# Altium project MdBBCar_CenterBoard.PrjPcb
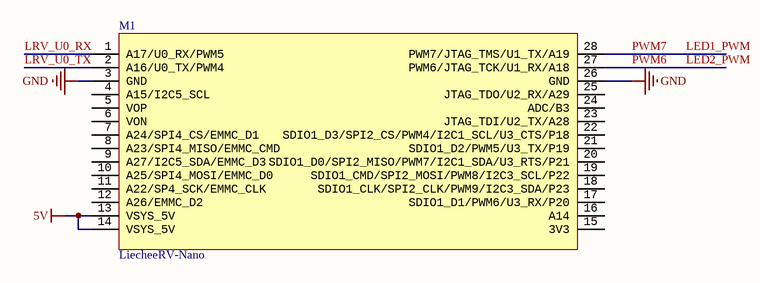
[diagram p0: MaixCAMPort.SchDoc]
4 sheets, 39 parts. Net scope: global (net labels, ports and power ports of the same name join across sheets).
Board file: MdBBCar_CenterBoad.PcbDoc
Sheets:
  MaixCAMPort.SchDoc
  CarPower.SchDoc
  Connector.SchDoc
  GimbalFPV.SchDoc

## Sheet MaixCAMPort.SchDoc
size A4; SheetNumber: 1; SheetTotal: 4

### Parts
M1  LiecheeRV-Nano  [LicheeRV-Nano(SDIO_NC)-半孔探针]

### Nets
5V: M1.13(VSYS_5V) M1.14(VSYS_5V)
GND: M1.3(GND) M1.26(GND)
LED1_PWM: M1.28(PWM7/JTAG_TMS/U1_TX/A19)  [also labelled PWM7]
LED2_PWM: M1.27(PWM6/JTAG_TCK/U1_RX/A18)  [also labelled PWM6]
LRV_U0_RX: M1.1(A17/U0_RX/PWM5)
LRV_U0_TX: M1.2(A16/U0_TX/PWM4)

Not connected (* = marked no-connect by the designer): M1 4(A15/I2C5_SCL) 5(VOP) 6(VON) 7(A24/SPI4_CS/EMMC_D1) 8(A23/SPI4_MISO/EMMC_CMD) 9(A27/I2C5_SDA/EMMC_D3) 10(A25/SPI4_MOSI/EMMC_D0) 11(A22/SP4_SCK/EMMC_CLK) 12(A26/EMMC_D2) 15(3V3) 16(A14) 17(SDIO1_D1/PWM6/U3_RX/P20) 18(SDIO1_CLK/SPI2_CLK/PWM9/I2C3_SDA/P23) 19(SDIO1_CMD/SPI2_MOSI/PWM8/I2C3_SCL/P22) 20(SDIO1_D0/SPI2_MISO/PWM7/I2C1_SDA/U3_RTS/P21) 21(SDIO1_D2/PWM5/U3_TX/P19) 22(SDIO1_D3/SPI2_CS/PWM4/I2C1_SCL/U3_CTS/P18) 23(JTAG_TDI/U2_TX/A28) 24(ADC/B3) 25(JTAG_TDO/U2_RX/A29)

### Library data of the parts
M1 = LiecheeRV-Nano: Sipeed MaixCAM模块

## Sheet CarPower.SchDoc
size A4; SheetNumber: 2; SheetTotal: 4
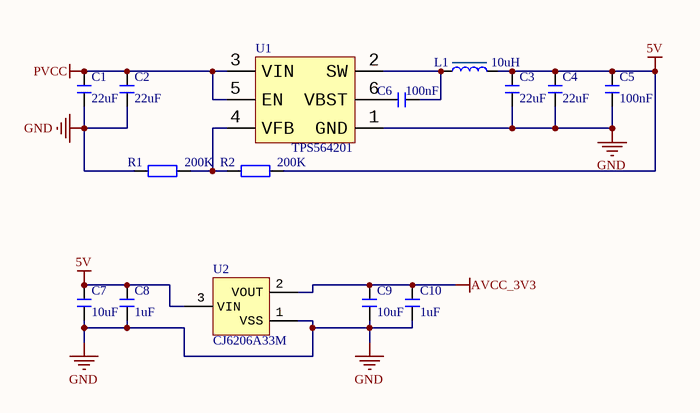
[diagram p1: CarPower.SchDoc]

### Parts
C1  22uF  [C 0805_L]
C2  22uF  [C 0805_L]
C3  22uF  [C 0603_L]
C4  22uF  [C 0603_L]
C5  100nF  [C 0402_L]
C6  100nF  [C 0402_L]
C7  10uF  [C 0402_L]
C8  1uF  [C 0402_L]
C9  10uF  [C 0402_L]
C10  1uF  [C 0402_L]
L1  10uH  [L-0630]
R1  200K  [R 0402_L]
R2  200K  [R 0402_L]
U1  TPS564201  [SOT23-6L]
U2  CJ6206A33M  [SOT23-3L]

### Nets
5V: C3.2 C4.2 C5.2 C7.2 C8.2 L1.2 R2.2 U2.3(VIN)
AVCC_3V3: C9.2 C10.2 U2.2(VOUT)
GND: C1.1 C2.1 C3.1 C4.1 C5.1 C7.1 C8.1 C9.1 C10.1 R1.1 U1.1(GND) U2.1(VSS)
PVCC: C1.2 C2.2 U1.3(VIN) U1.5(EN)
NetC6_1: C6.1 U1.6(VBST)
NetC6_2: C6.2 L1.1 U1.2(SW)
NetR1_2: R1.2 R2.1 U1.4(VFB)

### Library data of the parts
C1-C10 = C: 无极性贴片电容; 版权归属: 源创客; BOM名称: 无极性贴片电容; 学习资源: www.ooocke.com
L1 = L-CD: 贴片功率电感; BOM名称: 功率电感; 版权归属: 源创客; 学习资源: www.ooocke.com
R1 R2 = R: 贴片电阻; 版权归属: 源创客; BOM名称: 贴片电阻; 学习资源: www.ooocke.com
U1 = TPS563200: 3A  4.5V-17V输入 同步
U2 = LN6206PXXX: 三端稳压芯片 / 6V 250mA

## Sheet Connector.SchDoc
size A4; SheetNumber: 3; SheetTotal: 3
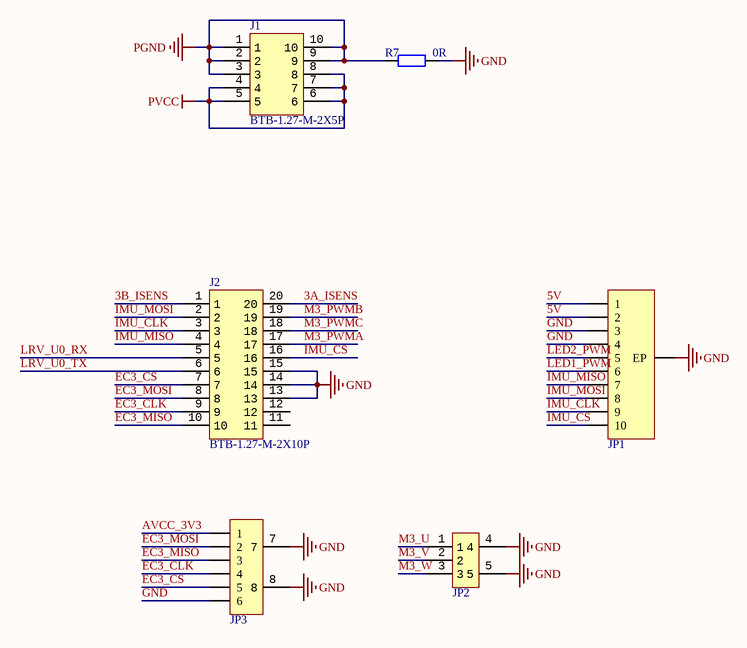
[diagram p2: Connector.SchDoc]

### Parts
J1  BTB-1.27-M-2X5P  [1.27-M-2X5P]
J2  BTB-1.27-M-2X10P  [1.27-M-2X10P]
JP1  FPC1.0-10P  [FPC0.5 1H-WS-10P]  (value not drawn)
JP2  HDR-1X3  [GH 1.25-LS-3P]  (value not drawn)
JP3  HDR-1X6  [GH1.25-LS-6P]  (value not drawn)
R7  0R  [R 1206_L]

### Nets
5V: JP1.1 JP1.2
AVCC_3V3: JP3.1
GND: J2.13 J2.14 J2.15 JP1.0(EP) JP1.3 JP1.4 JP2.4 JP2.5 JP3.6 JP3.7 JP3.8 R7.2
PGND: J1.1 J1.2 J1.3 J1.9 J1.10 R7.1
PVCC: J1.4 J1.5 J1.6 J1.7 J1.8
3A_ISENS: J2.20
3B_ISENS: J2.1
EC3_CLK: J2.9 JP3.4
EC3_CS: J2.7 JP3.5
EC3_MISO: J2.10 JP3.3
EC3_MOSI: J2.8 JP3.2
IMU_CLK: J2.3 JP1.9
IMU_CS: J2.16 JP1.10
IMU_MISO: J2.4 JP1.7
IMU_MOSI: J2.2 JP1.8
LED1_PWM: JP1.6
LED2_PWM: JP1.5
LRV_U0_RX: J2.5
LRV_U0_TX: J2.6
M3_PWMA: J2.17
M3_PWMB: J2.19
M3_PWMC: J2.18
M3_U: JP2.1  [project net 3A_ISENS_N]
M3_V: JP2.2  [project net 3B_ISENS_N]
M3_W: JP2.3

Not connected (* = marked no-connect by the designer): J2 11 12

### Library data of the parts
J1 = M-2X5P
J2 = M-2X10P
JP1 = FPC-10P: FPC连接器; 版权归属: 源创客; BOM名称: FPC连接器; 学习资源: www.ooocke.com
JP2 = Header 3: 3P接插件; 版权归属: 源创客; BOM名称: 3P接插件; 学习资源: www.ooocke.com
JP3 = Header 6: 6P接插件; 版权归属: 源创客; BOM名称: 6P接插件; 学习资源: www.ooocke.com
R7 = R: 贴片电阻; 版权归属: 源创客; BOM名称: 贴片电阻; 学习资源: www.ooocke.com

## Sheet GimbalFPV.SchDoc
size A4; SheetNumber: 4; SheetTotal: 4
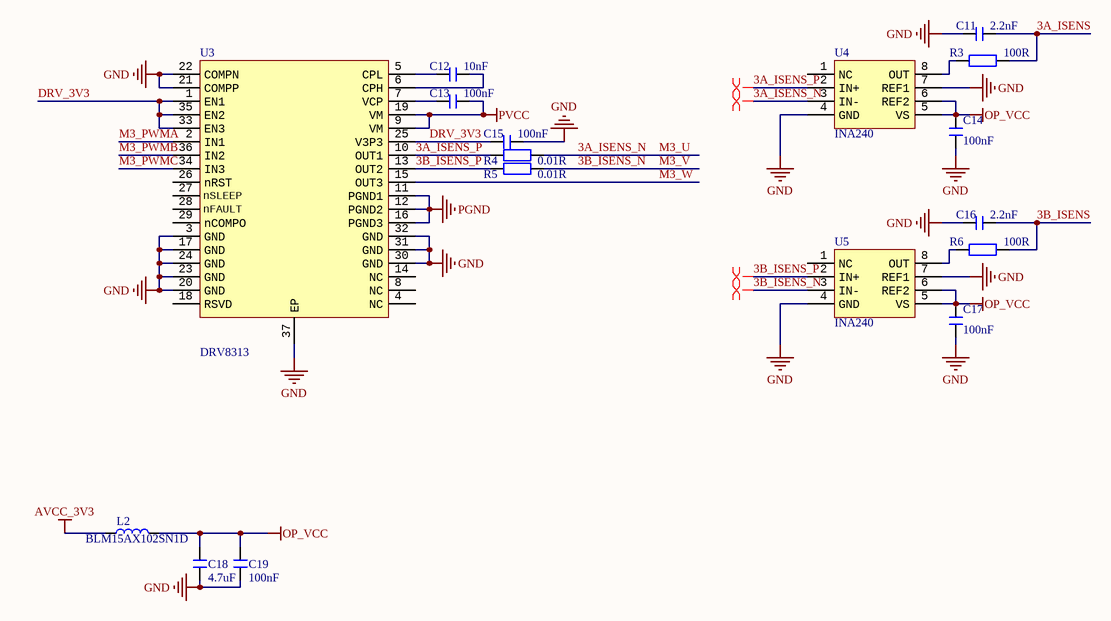
[diagram p3: GimbalFPV.SchDoc]

### Parts
C11  2.2nF  [C 0402_L]
C12  10nF  [C 0402_L]
C13  100nF  [C 0402_L]
C14  100nF  [C 0402_L]
C15  100nF  [C 0402_L]
C16  2.2nF  [C 0402_L]
C17  100nF  [C 0402_L]
C18  4.7uF  [C 0402_L]
C19  100nF  [C 0402_L]
L2  BLM15AX102SN1D  [L 0402]
R3  100R  [R 0402_L]
R4  0.01R  [RI 1206]
R5  0.01R  [RI 1206]
R6  100R  [R 0402_L]
U3  DRV8313  [VQFN-36-6X6]
U4  INA240  [SSOP8_L]
U5  INA240  [SSOP8_L]

### Nets
AVCC_3V3: L2.1
GND: C11.1 C14.1 C15.2 C16.1 C17.1 C18.1 C19.1 U3.3(GND) U3.17(GND) U3.20(GND) U3.21(COMPP) U3.22(COMPN) U3.23(GND) U3.24(GND) U3.30(GND) U3.31(GND) U3.32(GND) U3.37(EP) U4.4(GND) U4.7(REF1) U5.4(GND) U5.7(REF1)
OP_VCC: C14.2 C17.2 C18.2 C19.2 L2.2 U4.5(VS) U4.6(REF2) U5.5(VS) U5.6(REF2)
PGND: U3.11(PGND1) U3.12(PGND2) U3.16(PGND3)
PVCC: C13.2 U3.9(VM) U3.19(VM)
3A_ISENS: C11.2 R3.2
3A_ISENS_N: R4.2 U4.3(IN-)  [also labelled M3_U]
3A_ISENS_P: R4.1 U3.10(OUT1) U4.2(IN+)
3B_ISENS: C16.2 R6.2
3B_ISENS_N: R5.2 U5.3(IN-)  [also labelled M3_V]
3B_ISENS_P: R5.1 U3.13(OUT2) U5.2(IN+)
DRV_3V3: C15.1 U3.1(EN1) U3.25(V3P3) U3.33(EN3) U3.35(EN2)
M3_PWMA: U3.2(IN1)
M3_PWMB: U3.36(IN2)
M3_PWMC: U3.34(IN3)
M3_W: U3.15(OUT3)
NetC12_1: C12.1 U3.5(CPL)
NetC12_2: C12.2 U3.6(CPH)
NetC13_1: C13.1 U3.7(VCP)
NetR3_1: R3.1 U4.8(OUT)
NetR6_1: R6.1 U5.8(OUT)

Not connected (* = marked no-connect by the designer): U3 4(NC) 8(NC) 14(NC) 18(RSVD) 26(nRST) 27(nSLEEP) 28(nFAULT) 29(nCOMPO); U4 1(NC); U5 1(NC)

### Layout directives
differential pair: 3A_ISENS_N, 3A_ISENS_P, 3B_ISENS_N, 3B_ISENS_P

### Library data of the parts
C11-C19 = C: 无极性贴片电容; 版权归属: 源创客; BOM名称: 无极性贴片电容; 学习资源: www.ooocke.com
L2 = L: 小功率贴片电感; 版权归属: 源创客; BOM名称: 小功率贴片电感; 学习资源: www.ooocke.com
R3 R6 = R: 贴片电阻; 版权归属: 源创客; BOM名称: 贴片电阻; 学习资源: www.ooocke.com
R4 R5 = R-I: 电流检测电阻; 版权归属: 源创客; BOM名称: 电流检测电阻; 学习资源: www.ooocke.com
U3 = DRV8313: 集成FET的3路半桥驱动器 / 3A
U4 U5 = INA240: PWM抑制电流检测芯片

## Nets that join several sheets
5V: MaixCAMPort (M1.13 M1.14), CarPower (8 pins), Connector (JP1.1 JP1.2)
AVCC_3V3: CarPower (C9.2 C10.2 U2.2), Connector (JP3.1), GimbalFPV (L2.1)
GND: MaixCAMPort (M1.3 M1.26), CarPower (12 pins), Connector (12 pins), GimbalFPV (22 pins)
PGND: Connector (6 pins), GimbalFPV (U3.11 U3.12 U3.16)
PVCC: CarPower (C1.2 C2.2 U1.3 U1.5), Connector (5 pins), GimbalFPV (C13.2 U3.9 U3.19)
3A_ISENS: Connector (J2.20), GimbalFPV (C11.2 R3.2)
3A_ISENS_N: Connector (JP2.1), GimbalFPV (R4.2 U4.3)
3B_ISENS: Connector (J2.1), GimbalFPV (C16.2 R6.2)
3B_ISENS_N: Connector (JP2.2), GimbalFPV (R5.2 U5.3)
LED1_PWM: MaixCAMPort (M1.28), Connector (JP1.6)
LED2_PWM: MaixCAMPort (M1.27), Connector (JP1.5)
LRV_U0_RX: MaixCAMPort (M1.1), Connector (J2.5)
LRV_U0_TX: MaixCAMPort (M1.2), Connector (J2.6)
M3_PWMA: Connector (J2.17), GimbalFPV (U3.2)
M3_PWMB: Connector (J2.19), GimbalFPV (U3.36)
M3_PWMC: Connector (J2.18), GimbalFPV (U3.34)
M3_W: Connector (JP2.3), GimbalFPV (U3.15)